# EAGLE design USB power converter (EAGLE 7.2.0)
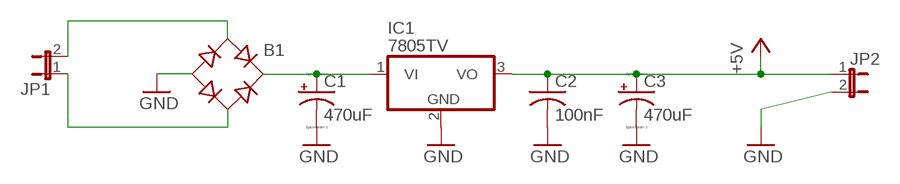
[diagram p0: schematic, sheet 1]

## Parts
B1  RB1A  [RB1A]
C1  470uF  CPOL-USE3.5-8  [E3,5-8]
C2  100nF  C-US025-024X044  [C025-024X044]
C3  470uF  CPOL-USE3.5-8  [E3,5-8]
IC1  7805TV  [TO220V]
JP1  JP1E  [JP1]
JP2  JP1E  [JP1]

## Nets
+5V: C2.1 C3.+ IC1.3(VO) JP2.1
GND: B1.- C1.- C2.2 C3.- IC1.2(GND) JP2.2
N$2: B1.AC1 JP1.2
N$3: B1.AC2 JP1.1
N$4: B1.+ C1.+ IC1.1(VI)

## Library data of the parts
B1 = rectifier:RB1A: RECTIFIER 1 A
C1 C3 = resistor:CPOL-US: POLARIZED CAPACITOR, American symbol
C2 = resistor:C-US: CAPACITOR, American symbol
IC1 = linear:78*: Positive VOLTAGE REGULATOR Source: http://cache.national.com/ds/LM/LM78L05.pdf http://www.fairchildsemi.com/ds/LM/LM7805.pdf
JP1 JP2 = jumper:JP1E: JUMPER

## Board
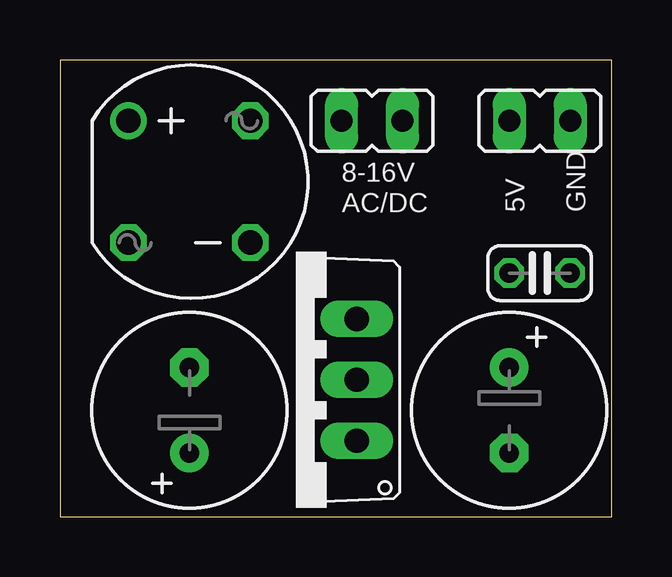
[diagram p1: board, top side]
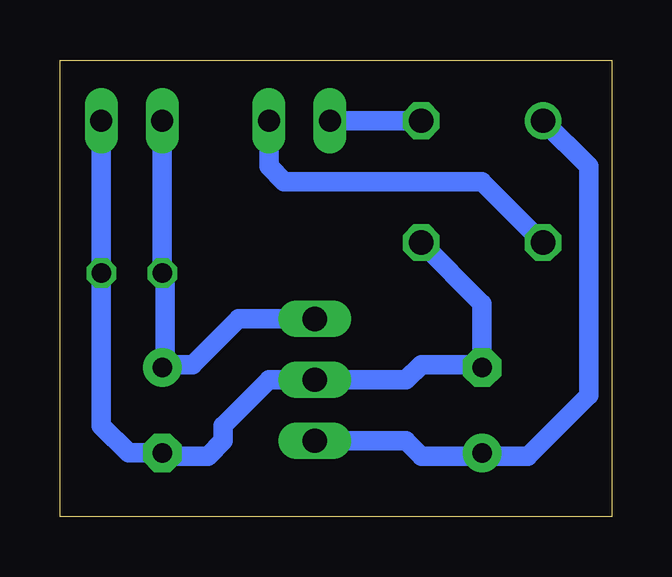
[diagram p2: board, bottom side, seen from below]

Size 23 x 19.04 mm. Coordinates in mm from the lower left corner, seen from the top.
Outline: 0,0 23,0 23,19.04 0,19.04 0,0
Copper layers (1*16): Top 0.0356mm / dielectric 1.5011mm / Bottom 0.0356mm
Design rules "LaenPCBOrder": minimum track width 6mil, minimum drill 13mil, track to track 6mil, track to pad 6mil, pad to pad 6mil, via to via 6mil, smd to smd 6mil, copper to edge 15mil, drill to drill 6mil, minimum pad ring 7mil, minimum via ring 7mil, stop-mask expansion 3mil, vias tented up to drill 0mil, thermal gap 10mil

### Footprints (pad centres in the part's own frame; a part is rotated, then mirrored left to right if it is on the bottom)
RB1A = drill 1.016: + -2.54,2.54 | drill 1.016 octagon: - 2.54,-2.54; AC1 2.54,2.54; AC2 -2.54,-2.54
E3,5-8 = drill 0.813 pad 1.6: + -1.778,0 | drill 0.813 pad 1.6 octagon: - 1.778,0
C025-024X044 = drill 0.813 octagon: 1 -1.27,0; 2 1.27,0
TO220V = drill 1.016 long: 1 -2.54,-2.54; 2 0,-2.54; 3 2.54,-2.54
JP1 = drill 0.914 long: 1 0,-1.27; 2 0,1.27

### Placement (x,y rotation side)
B1  5.4,13.97 0 top
C1  5.4,4.45 90 top
C2  20,10.16 0 top
C3  18.73,4.45 270 top
IC1  9.84,5.71 90 top
JP1  13.02,16.51 90 top
JP2  20,16.51 270 top

### Tracks (layer width: path | path; a pad name or v marks a point on that pad's centre or on a via)
+5V
  Bottom 0.813: IC1.3 15.56,8.26 17.46,6.35 18.61,6.35 | 18.61,6.35 C3.+ | 18.61,6.35 18.61,10.03 C2.1 JP2.1
GND
  Bottom 0.813: JP2.2 C2.2 21.27,3.81 20.13,2.67 C3.- 18.61,2.54 16.83,2.54 16.19,3.17 16.19,3.81 14.29,5.71 IC1.2 8.57,5.71 7.94,6.35 5.4,6.35 C1.- 5.4,8.89 B1.-
N$2
  Bottom 0.813: B1.AC1 JP1.2
N$3
  Bottom 0.813: B1.AC2 5.4,13.97 13.65,13.97 14.29,14.61 JP1.1
N$4
  Bottom 0.813: B1.+ 0.95,14.61 0.95,5.08 3.49,2.54 5.27,2.54 C1.+ 5.52,2.54 7.94,2.54 8.57,3.17 IC1.1

### Text on the board
tPlace: 8-16V | AC/DC | 5V | GND